# EAGLE design W021 Mk2 (EAGLE 9.5.1)
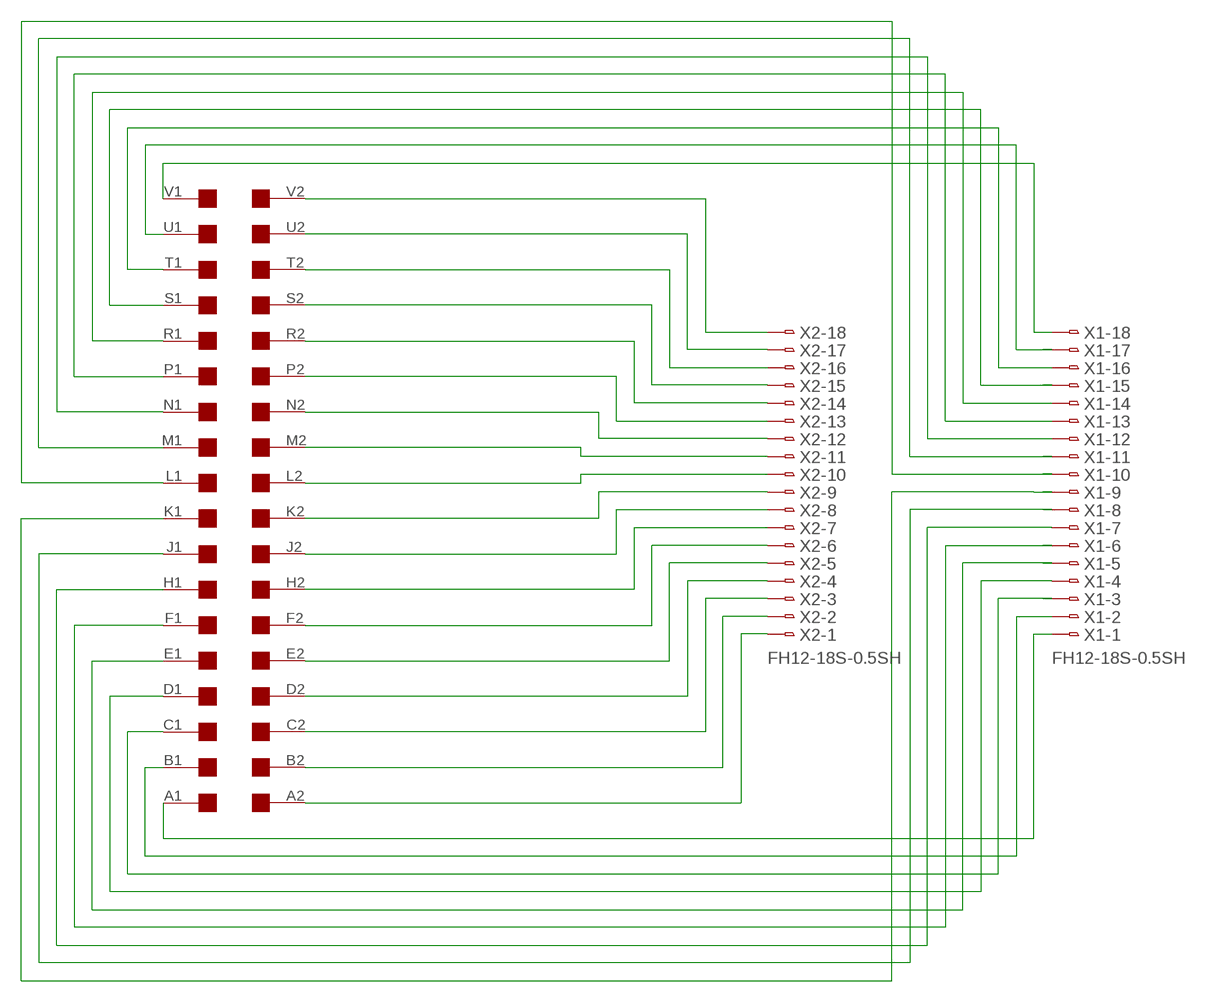
[diagram p0: schematic, sheet 1]

## Parts
EDGE1  EDGE-2CONNECTOR  [EDGE-CON2]
X1  FH12-18S-0.5SH  [FH12-18S-0.5SH]
X2  FH12-18S-0.5SH  [FH12-18S-0.5SH]

## Nets
N$1: EDGE1.V2 X2.18
N$2: EDGE1.U2 X2.17
N$3: EDGE1.T2 X2.16
N$4: EDGE1.S2 X2.15
N$5: EDGE1.R2 X2.14
N$6: EDGE1.P2 X2.13
N$7: EDGE1.N2 X2.12
N$8: EDGE1.M2 X2.11
N$9: EDGE1.L2 X2.10
N$10: EDGE1.K2 X2.9
N$11: EDGE1.J2 X2.8
N$12: EDGE1.H2 X2.7
N$13: EDGE1.F2 X2.6
N$14: EDGE1.E2 X2.5
N$15: EDGE1.D2 X2.4
N$16: EDGE1.C2 X2.3
N$17: EDGE1.B2 X2.2
N$19: EDGE1.V1 X1.18
N$20: EDGE1.U1 X1.17
N$21: EDGE1.T1 X1.16
N$23: EDGE1.R1 X1.14
N$25: EDGE1.N1 X1.12
N$27: EDGE1.L1 X1.10
N$32: EDGE1.D1 X1.4
N$33: EDGE1.E1 X1.5
N$34: EDGE1.F1 X1.6
N$37: EDGE1.A2 X2.1
N$39: EDGE1.M1 X1.11
N$41: EDGE1.S1 X1.15
N$43: EDGE1.P1 X1.13
N$44: EDGE1.A1
N$45: EDGE1.K1 X1.9
N$46: EDGE1.B1
N$47: EDGE1.J1 X1.8
N$48: EDGE1.H1 X1.7
N$52: EDGE1.C1 X1.3
N$53: X1.2
N$54: X1.1

## Library data of the parts
EDGE1 = dec-con:EDGE-2: Double-Sided DEC edge connector.
X1 X2 = con-hirose:FH12-18S-0.5S: 0.5mm Pitch Connectors For FPC/FFC Source: Data sheet <http://www.hirose.co.jp/cataloge_hp/e58605370.pdf>; MPN: FH12-18S-0.5SH(55); OC_FARNELL: 1324547; OC_NEWARK: 34M6164

## Board
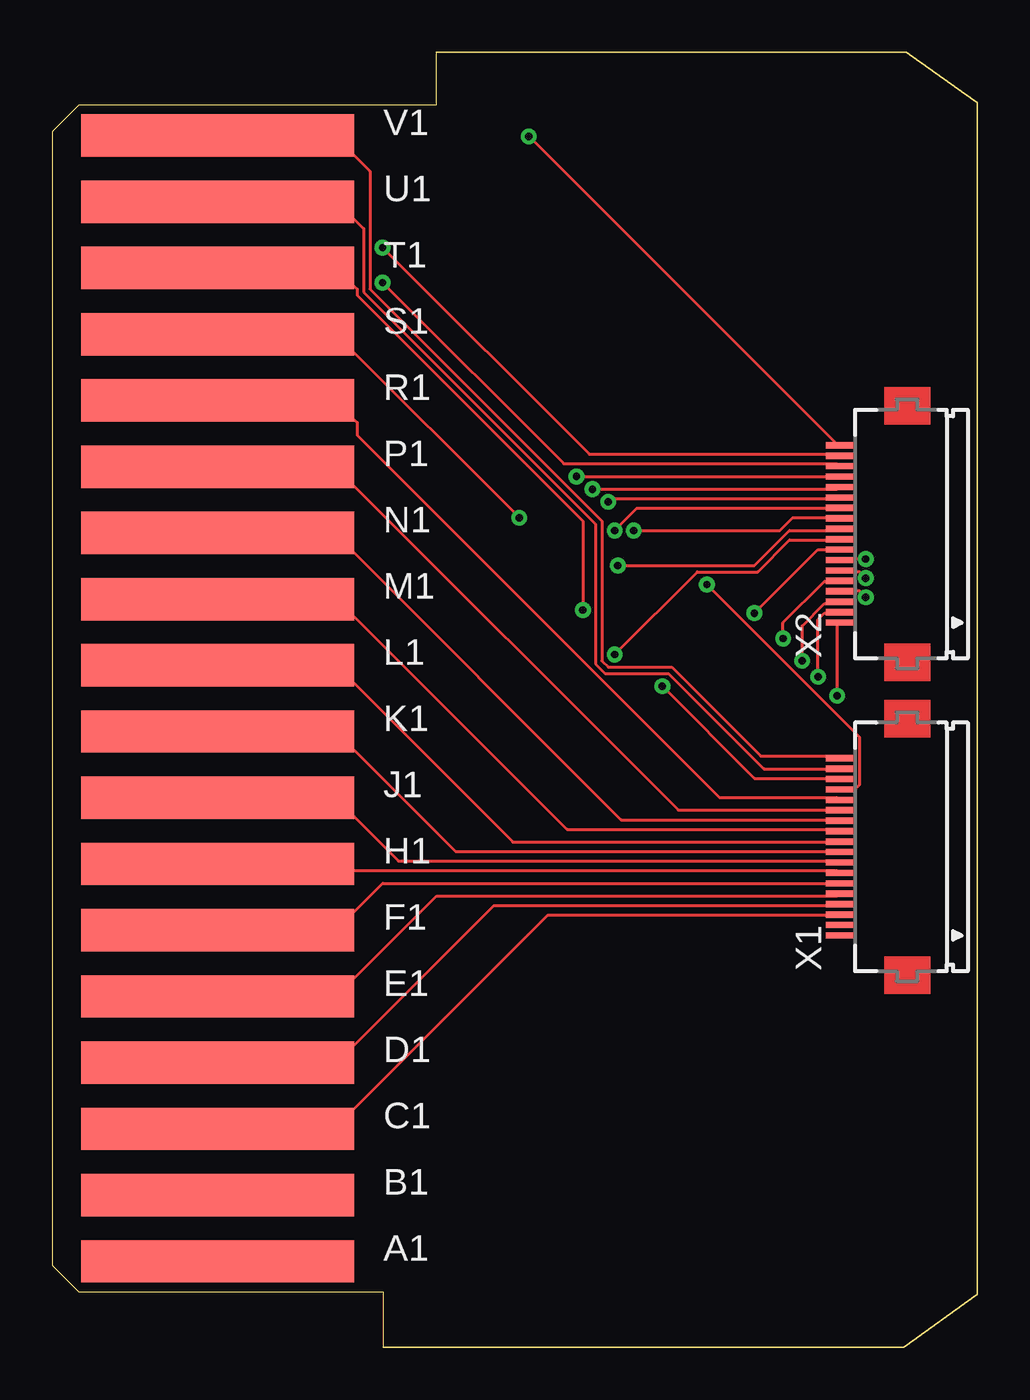
[diagram p1: board, top side]
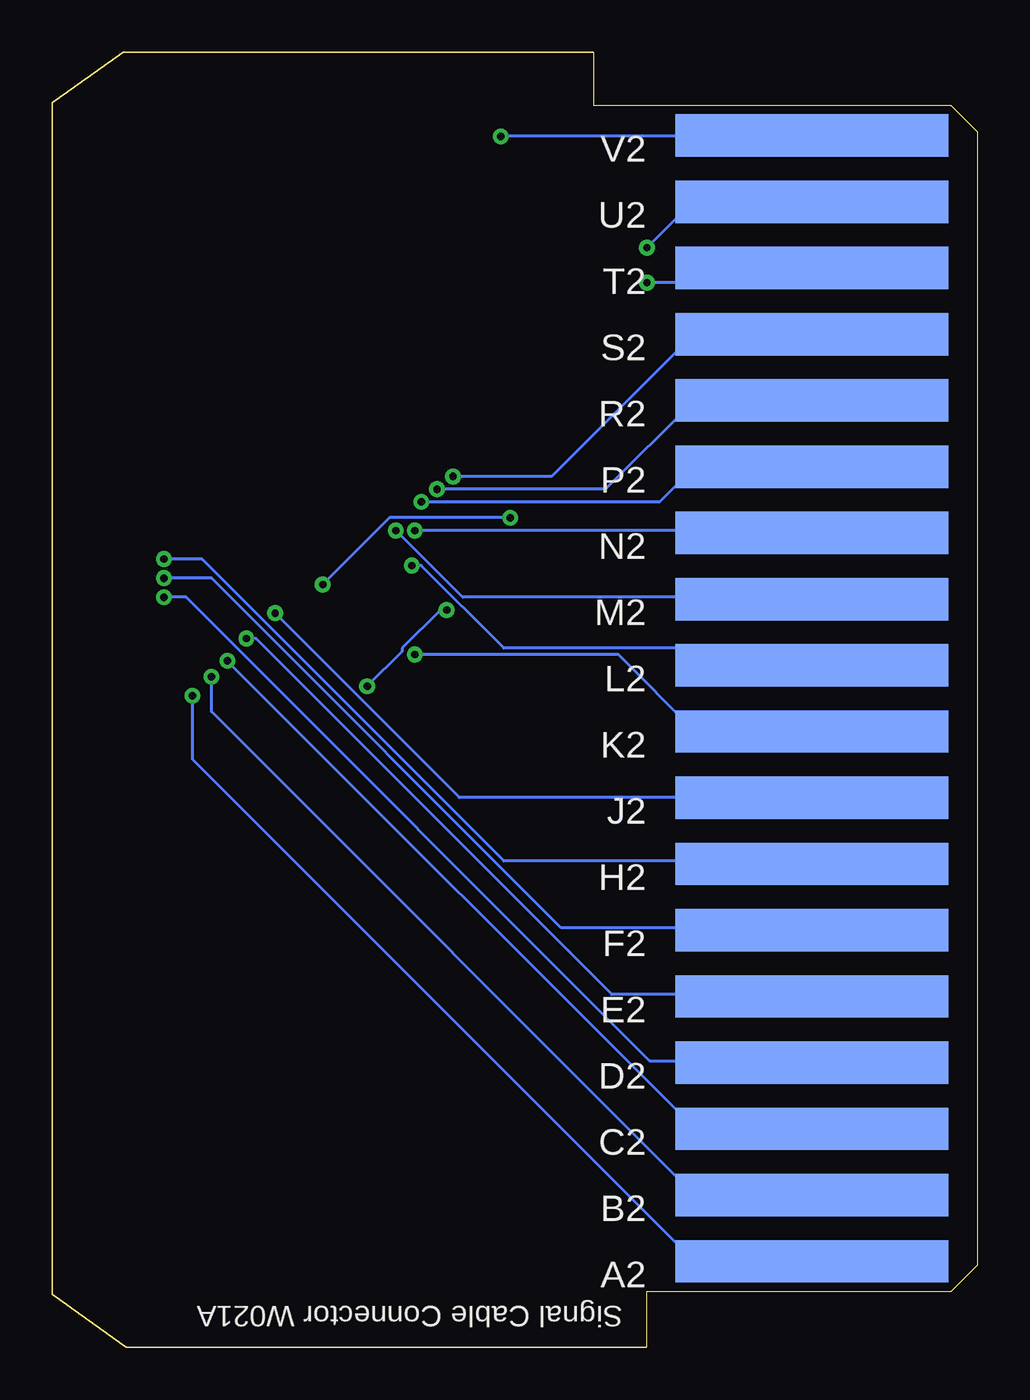
[diagram p2: board, bottom side, seen from below]

Size 44.37 x 62.1 mm. Coordinates in mm from the lower left corner, seen from the top.
Outline: 18.41,62.1 40.96,62.1 44.37,59.69 44.37,2.54 40.83,0 15.88,0
Copper layers (1*16): Top 0.035mm / dielectric 1.5mm / Bottom 0.035mm
Design rules "default *": minimum track width 6mil, minimum drill 0.35mm, track to track 6mil, track to pad 6mil, pad to pad 6mil, via to via 6mil, smd to smd 6mil, copper to edge 40mil, drill to drill 6mil, minimum pad ring 10mil, minimum via ring 8mil, stop-mask expansion 4mil, vias tented up to drill 0mil, thermal gap 10mil

### Footprints (pad centres in the part's own frame; a part is rotated, then mirrored left to right if it is on the bottom)
EDGE-CON2 = smd 13.106 x 2.032: A1 7.938,4.128; B1 7.938,7.303; C1 7.938,10.477; D1 7.938,13.652; E1 7.938,16.828; F1 7.938,20.003; H1 7.938,23.177; J1 7.938,26.352; K1 7.938,29.527; L1 7.938,32.703; M1 7.938,35.877; N1 7.938,39.053; P1 7.938,42.227; R1 7.938,45.403; S1 7.938,48.578; T1 7.938,51.752; U1 7.938,54.928; V1 7.938,58.102 | smd 13.106 x 2.032 bottom: A2 7.938,4.128; B2 7.938,7.303; C2 7.938,10.477; D2 7.938,13.652; E2 7.938,16.828; F2 7.938,20.003; H2 7.938,23.177; J2 7.938,26.352; K2 7.938,29.527; L2 7.938,32.703; M2 7.938,35.877; N2 7.938,39.053; P2 7.938,42.227; R2 7.938,45.403; S2 7.938,48.578; T2 7.938,51.752; U2 7.938,54.928; V2 7.938,58.102
FH12-18S-0.5SH = smd 0.3 x 1.3: 1 -4.25,3.25; 2 -3.75,3.25; 3 -3.25,3.25; 4 -2.75,3.25; 5 -2.25,3.25; 6 -1.75,3.25; 7 -1.25,3.25; 8 -0.75,3.25; 9 -0.25,3.25; 10 0.25,3.25; 11 0.75,3.25; 12 1.25,3.25; 13 1.75,3.25; 14 2.25,3.25; 15 2.75,3.25; 16 3.25,3.25; 17 3.75,3.25; 18 4.25,3.25

### Placement (x,y rotation side)
EDGE1  0,0 0 top
X1  41,24 90 top
X2  41,39 90 top

### Tracks (layer width: path | path; a pad name or v marks a point on that pad's centre or on a via)
N$1  (via drill 0.35)
  Top 0.152: v22.86,58.06 37.64,43.28 X2.18
  Bottom 0.152: v22.86,58.06 8.08,58.06 EDGE1.V2
N$2  (via drill 0.35)
  Top 0.152: v15.85,52.73 25.76,42.82 37.64,42.82 X2.17
  Bottom 0.152: v15.85,52.73 13.72,54.86 8.08,54.86 EDGE1.U2
N$3  (via drill 0.35)
  Top 0.152: v15.85,51.05 24.54,42.37 37.64,42.37 X2.16
  Bottom 0.152: v15.85,51.05 8.69,51.05 8.08,51.66 EDGE1.T2
N$4  (via drill 0.35)
  Top 0.152: v25.15,41.76 37.64,41.76 X2.15
  Bottom 0.152: v25.15,41.76 20.42,41.76 13.72,48.46 8.08,48.46 EDGE1.S2
N$5  (via drill 0.35)
  Top 0.152: v25.91,41.15 37.64,41.15 X2.14
  Bottom 0.152: v25.91,41.15 17.83,41.15 13.72,45.26 8.08,45.26 EDGE1.R2
N$6  (via drill 0.35)
  Top 0.152: v26.67,40.54 26.82,40.69 37.64,40.69 X2.13
  Bottom 0.152: v26.67,40.54 15.24,40.54 13.56,42.22 8.08,42.22 EDGE1.P2
N$7  (via drill 0.35)
  Top 0.152: v26.98,39.17 28.04,40.23 37.64,40.23 X2.12
  Bottom 0.152: v26.98,39.17 8.08,39.17 EDGE1.N2
N$8  (via drill 0.35)
  Top 0.152: v27.89,39.17 34.9,39.17 35.51,39.78 37.64,39.78 X2.11
  Bottom 0.152: v27.89,39.17 24.69,35.97 8.08,35.97 EDGE1.M2
N$9  (via drill 0.35)
  Top 0.152: v27.13,37.49 33.68,37.49 35.36,39.17 37.64,39.17 X2.10
  Bottom 0.152: v27.13,37.49 26.67,37.49 22.71,33.53 8.84,33.53 8.08,32.77 EDGE1.L2
N$10  (via drill 0.35)
  Top 0.152: v26.98,33.22 30.94,37.19 33.83,37.19 35.36,38.71 37.64,38.71 X2.9
  Bottom 0.152: v26.98,33.22 17.22,33.22 13.56,29.57 8.08,29.57 EDGE1.K2
N$11  (via drill 0.35)
  Top 0.152: v33.68,35.2 36.73,38.25 37.64,38.25 X2.8
  Bottom 0.152: v33.68,35.2 24.84,26.36 8.08,26.36 EDGE1.J2
N$12  (via drill 0.35)
  Top 0.152: v39.01,37.8 37.8,37.8 X2.7
  Bottom 0.152: v39.01,37.8 37.19,37.8 22.71,23.32 8.08,23.32 EDGE1.H2
N$13  (via drill 0.35)
  Top 0.152: v39.01,36.88 38.71,37.19 37.8,37.19 X2.6
  Bottom 0.152: v39.01,36.88 36.73,36.88 19.96,20.12 8.08,20.12 EDGE1.F2
N$14  (via drill 0.35)
  Top 0.152: v35.05,33.98 35.05,34.75 37.03,36.73 37.64,36.73 X2.5
  Bottom 0.152: v35.05,33.98 34.59,33.98 17.53,16.92 8.08,16.92 EDGE1.E2
N$15  (via drill 0.35)
  Top 0.152: v39.01,35.97 38.71,36.27 37.8,36.27 X2.4
  Bottom 0.152: v39.01,35.97 37.95,35.97 15.7,13.72 8.08,13.72 EDGE1.D2
N$16  (via drill 0.35)
  Top 0.152: v35.97,32.92 35.97,34.59 37.03,35.66 37.64,35.66 X2.3
  Bottom 0.152: v35.97,32.92 13.56,10.52 8.08,10.52 EDGE1.C2
N$17  (via drill 0.35)
  Top 0.152: v36.73,32.16 36.73,34.9 37.03,35.2 37.64,35.2 X2.2
  Bottom 0.152: v36.73,32.16 36.73,30.48 13.56,7.32 8.08,7.32 EDGE1.B2
N$19
  Top 0.152: X1.18 37.64,28.35 33.98,28.35 29.72,32.61 26.67,32.61 26.36,32.92 26.36,39.62 15.24,50.75 15.24,56.39 13.56,58.06 8.08,58.06 EDGE1.V1
N$20
  Top 0.152: X1.17 37.64,27.74 34.14,27.74 29.57,32.31 26.52,32.31 26.06,32.77 26.06,39.47 14.94,50.6 14.94,53.65 13.72,54.86 8.08,54.86 EDGE1.U1
N$21  (via drill 0.35)
  Top 0.152: v29.26,31.7 33.68,27.28 37.64,27.28 X1.16 | v25.45,35.36 25.45,39.62 14.63,50.44 14.63,50.75 13.72,51.66 8.08,51.66 EDGE1.T1
  Bottom 0.152: v29.26,31.7 27.58,33.38 27.58,33.53 25.76,35.36 v25.45,35.36
N$23
  Top 0.152: X1.14 37.64,26.36 32,26.36 14.63,43.74 14.63,44.35 13.72,45.26 8.08,45.26 EDGE1.R1
N$25
  Top 0.152: X1.12 37.64,25.3 27.28,25.3 13.56,39.01 8.08,39.01 EDGE1.N1
N$27
  Top 0.152: X1.10 37.64,24.23 22.1,24.23 13.72,32.61 8.08,32.61 EDGE1.L1
N$32
  Top 0.152: X1.4 37.64,21.18 21.18,21.18 13.72,13.72 8.08,13.72 EDGE1.D1
N$33
  Top 0.152: X1.5 37.64,21.64 18.44,21.64 13.72,16.92 8.08,16.92 EDGE1.E1
N$34
  Top 0.152: X1.6 37.64,22.25 15.85,22.25 13.72,20.12 8.08,20.12 EDGE1.F1
N$37  (via drill 0.35)
  Top 0.152: v37.64,31.24 37.64,34.75 X2.1
  Bottom 0.152: v37.64,31.24 37.64,28.19 13.72,4.27 8.08,4.27 EDGE1.A2
N$39
  Top 0.152: X1.11 37.64,24.84 24.69,24.84 13.72,35.81 8.08,35.81 EDGE1.M1
N$41  (via drill 0.35)
  Top 0.152: v31.39,36.58 38.71,29.26 38.71,26.98 38.56,26.82 37.8,26.82 X1.15 | v22.4,39.78 13.72,48.46 8.08,48.46 EDGE1.S1
  Bottom 0.152: v31.39,36.58 28.19,39.78 v22.4,39.78
N$43
  Top 0.152: X1.13 37.64,25.76 30.02,25.76 13.56,42.22 8.08,42.22 EDGE1.P1
N$45
  Top 0.152: X1.9 37.64,23.77 19.36,23.77 13.72,29.41 8.08,29.41 EDGE1.K1
N$47
  Top 0.152: X1.8 37.64,23.32 16.61,23.32 13.72,26.21 8.08,26.21 EDGE1.J1
N$48
  Top 0.152: X1.7 37.64,22.86 8.38,22.86 8.08,23.16 EDGE1.H1
N$52
  Top 0.152: X1.3 37.64,20.73 23.77,20.73 13.56,10.52 8.08,10.52 EDGE1.C1

### Text on the board
bNames: Signal Cable Connector W021A